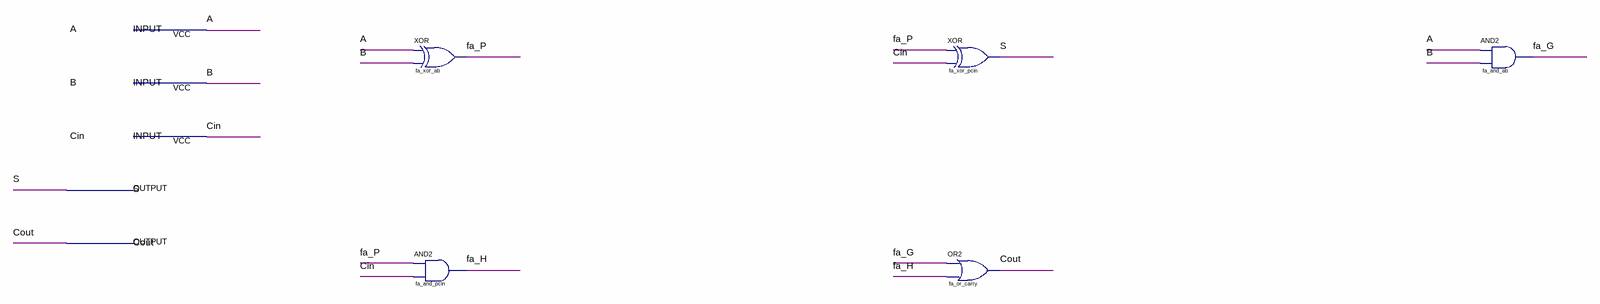
[diagram p0: schematic sheet]
// Quartus schematic somador_1bit.bdf as structural Verilog: 5 symbols, 5 pins
module somador_1bit (
  input  A,
  input  B,
  input  Cin,
  output S,
  output Cout
);

  wire fa_G, fa_H, fa_P;

  xor fa_xor_ab (fa_P, A, B);
  and fa_and_pcin (fa_H, fa_P, Cin);
  xor fa_xor_pcin (S, fa_P, Cin);
  or fa_or_carry (Cout, fa_G, fa_H);
  and fa_and_ab (fa_G, A, B);
endmodule
